# Altium project RemoteQuarium_pcb_design.PrjPcb
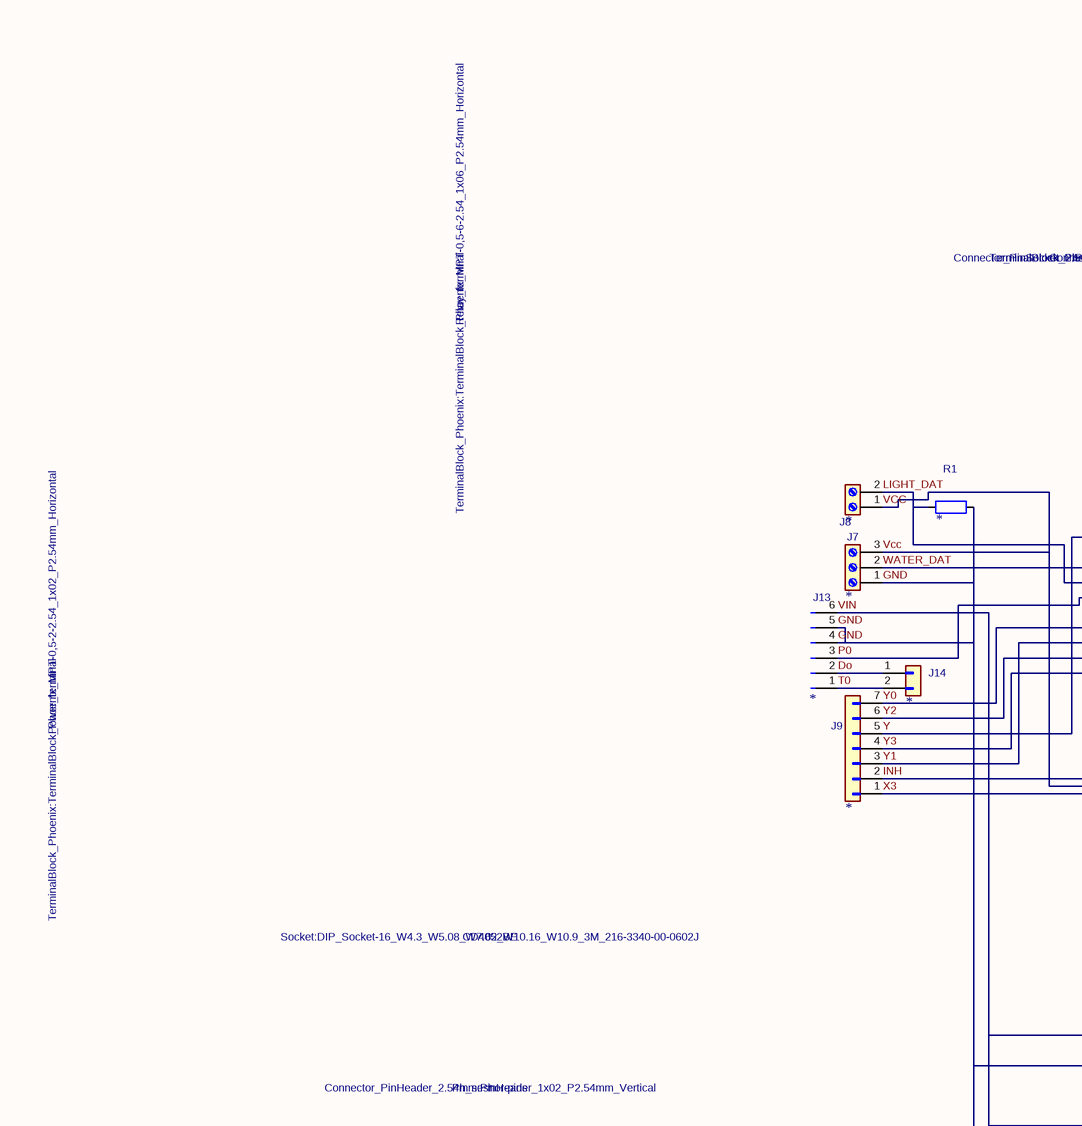
[diagram p0: RemoteQuarium_pcb_design.SchDoc, top left]
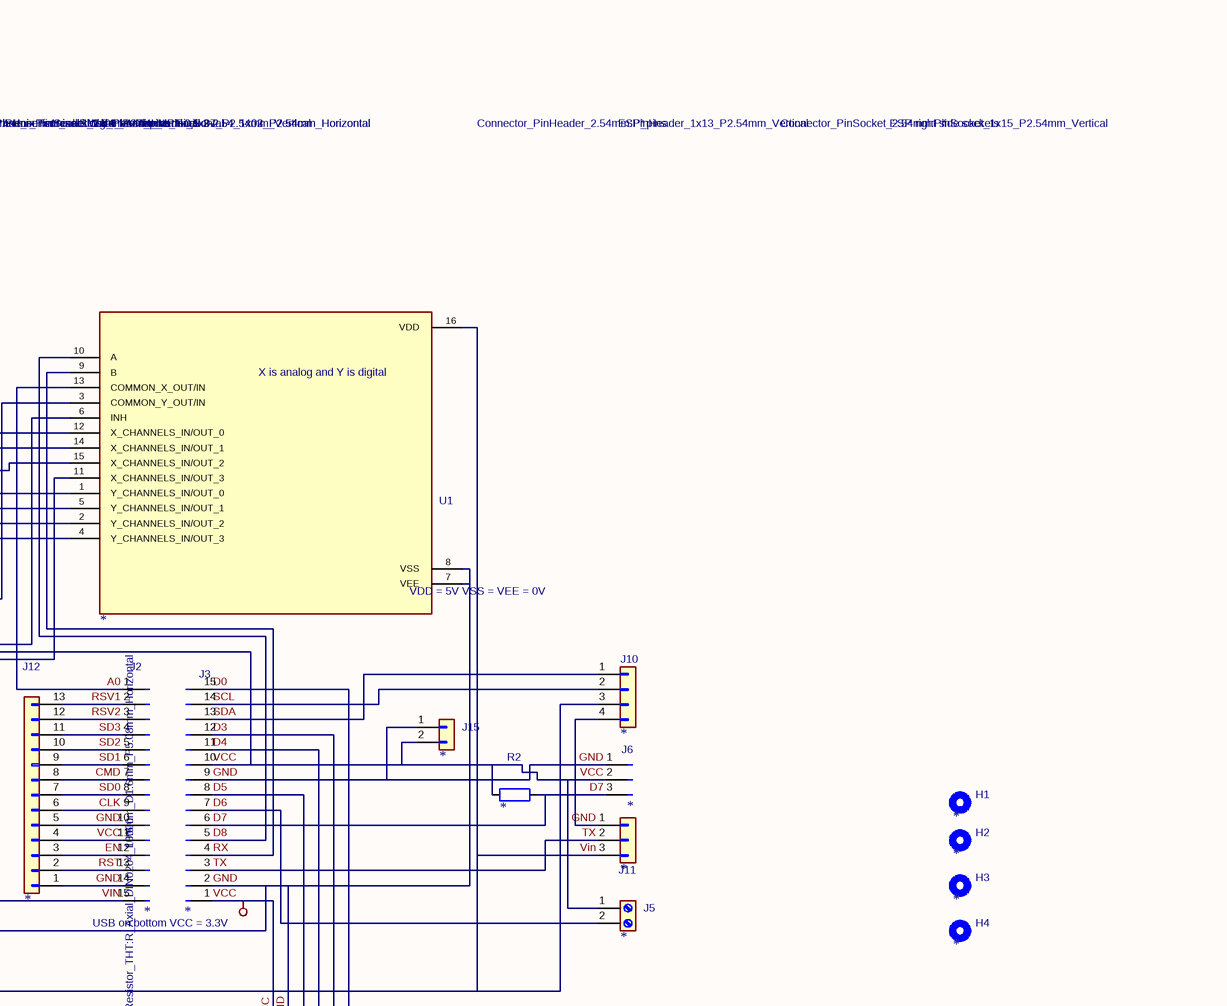
[diagram p1: RemoteQuarium_pcb_design.SchDoc, top right]
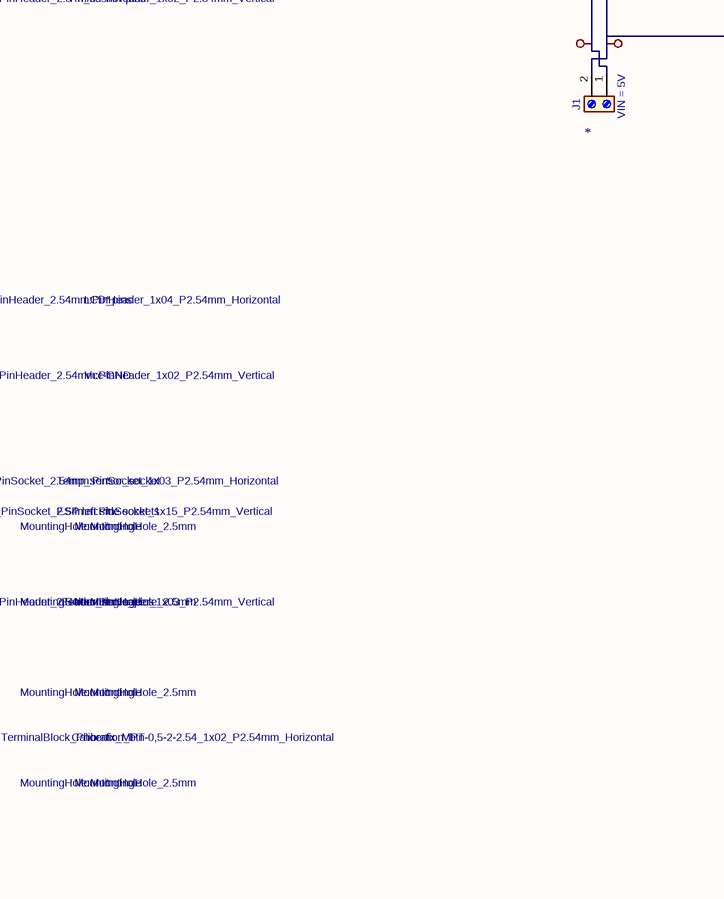
[diagram p2: RemoteQuarium_pcb_design.SchDoc, bottom left]
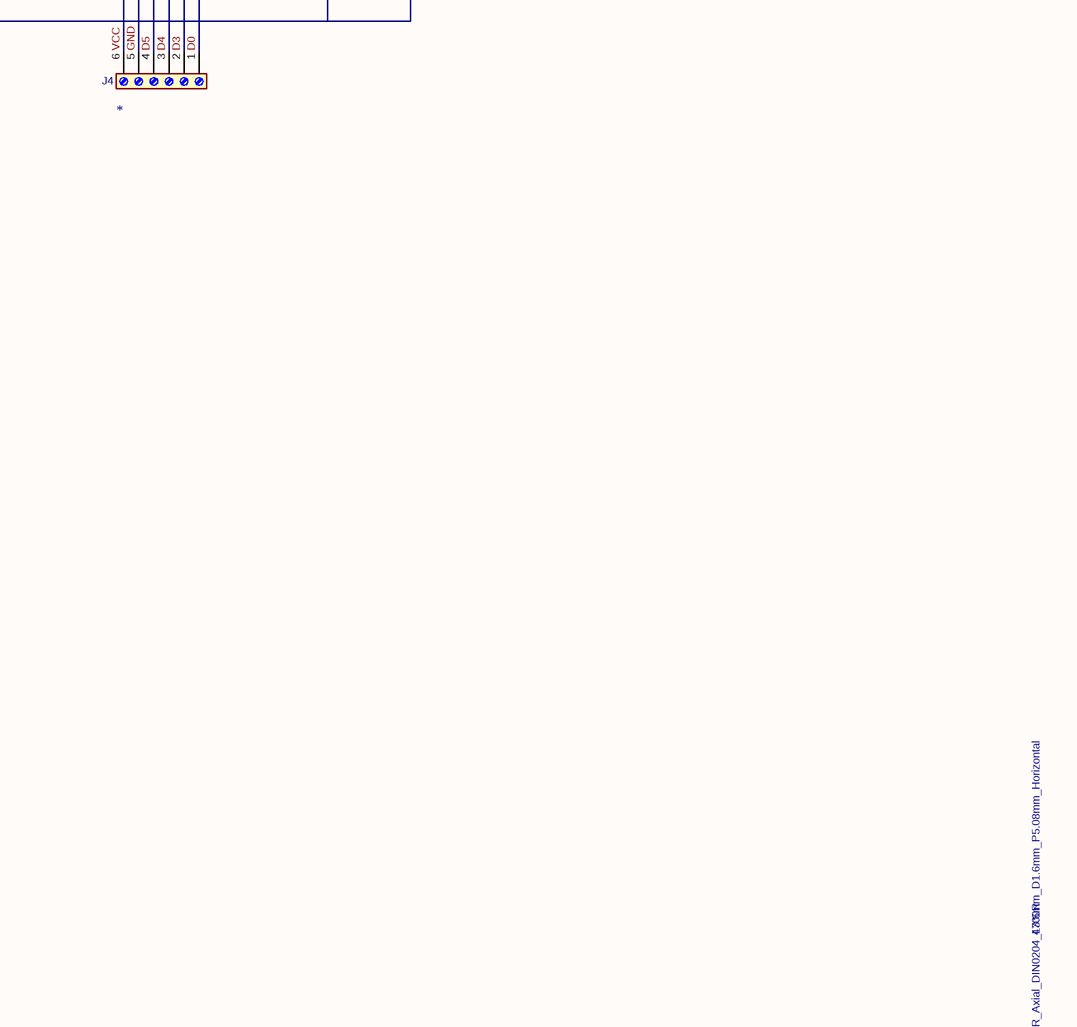
[diagram p3: RemoteQuarium_pcb_design.SchDoc, bottom right]
1 sheet, 22 parts. Net scope: global (net labels, ports and power ports of the same name join across sheets).
Board file: RemoteQuarium_pcb_design.PcbDoc

## Sheet RemoteQuarium_pcb_design.SchDoc
size 297 x 209 mm

### Parts
(Parts that share a designator on the sheet are numbered #1, #2 ... from top to bottom, then left to right.)
*#1  *  value Light_sensor_terminal  Reference: J8  Footprint: TerminalBlock_Phoenix:TerminalBlock_Phoenix_MPT-0,5-2-2.54_1x02_P2.54mm_Horizontal
*#2  *  value 10000  Reference: R1  Footprint: Resistor_THT:R_Axial_DIN0204_L3.6mm_D1.6mm_P5.08mm_Horizontal
*#3  *  value Water_sensor_terminal  Reference: J7  Footprint: TerminalBlock_Phoenix:TerminalBlock_Phoenix_MPT-0,5-3-2.54_1x03_P2.54mm_Horizontal
*#4  *  value CD4052BE  Reference: U1  Footprint: Socket:DIP_Socket-16_W4.3_W5.08_W7.62_W10.16_W10.9_3M_216-3340-00-0602J
*#5  *  value PH_sensor_sockets  Reference: J13  Footprint: Connector_PinSocket_2.54mm:PinSocket_1x06_P2.54mm_Horizontal
*#6  *  value Ph_sesnor-pins  Reference: J14  Footprint: Connector_PinHeader_2.54mm:PinHeader_1x02_P2.54mm_Vertical
*#7  *  value MUX_pins  Reference: J9  Footprint: Connector_PinHeader_2.54mm:PinHeader_1x07_P2.54mm_Vertical
*#8  *  value LCD_pins  Reference: J10  Footprint: Connector_PinHeader_2.54mm:PinHeader_1x04_P2.54mm_Horizontal
*#9  *  value Vcc-GND  Reference: J15  Footprint: Connector_PinHeader_2.54mm:PinHeader_1x02_P2.54mm_Vertical
*#10  *  value Temp_sensor_socket  Reference: J6  Footprint: Connector_PinSocket_2.54mm:PinSocket_1x03_P2.54mm_Horizontal
*#11  *  value ESP_pins  Reference: J12  Footprint: Connector_PinHeader_2.54mm:PinHeader_1x13_P2.54mm_Vertical
*#12  *  value ESP left side sockets  Reference: J2  Footprint: Connector_PinSocket_2.54mm:PinSocket_1x15_P2.54mm_Vertical
*#13  *  value ESP right side sockets  Reference: J3  Footprint: Connector_PinSocket_2.54mm:PinSocket_1x15_P2.54mm_Vertical
*#14  *  value 4700R  Reference: R2  Footprint: Resistor_THT:R_Axial_DIN0204_L3.6mm_D1.6mm_P5.08mm_Horizontal
*#15  *  value MountingHole  Reference: H1  Footprint: MountingHole:MountingHole_2.5mm
*#16  *  value Feeder_servo_pins  Reference: J11  Footprint: Connector_PinHeader_2.54mm:PinHeader_1x03_P2.54mm_Vertical
*#17  *  value MountingHole  Reference: H2  Footprint: MountingHole:MountingHole_2.5mm
*#18  *  value MountingHole  Reference: H3  Footprint: MountingHole:MountingHole_2.5mm
*#19  *  value Calibration_btn  Reference: J5  Footprint: TerminalBlock_Phoenix:TerminalBlock_Phoenix_MPT-0,5-2-2.54_1x02_P2.54mm_Horizontal
*#20  *  value MountingHole  Reference: H4  Footprint: MountingHole:MountingHole_2.5mm
*#21  *  value Relay_terminal  Reference: J4  Footprint: TerminalBlock_Phoenix:TerminalBlock_Phoenix_MPT-0,5-6-2.54_1x06_P2.54mm_Horizontal
*#22  *  value Power_terminal  Reference: J1  Footprint: TerminalBlock_Phoenix:TerminalBlock_Phoenix_MPT-0,5-2-2.54_1x02_P2.54mm_Horizontal

### Nets
GND: *#1.1(Pin_1) *#2.2 *#3.1(Pin_1) *#3.3(Pin_3) *#4.7(VEE) *#4.8(VSS) *#4.16(VDD) *#5.4(Pin_4) *#5.5(Pin_5) *#5.6(Pin_6) *#8.3(Pin_3) *#8.4(Pin_4) *#9.1(Pin_1) *#9.2(Pin_2) *#10.1(Pin_1) *#10.2(Pin_2) *#11.1(Pin_1) *#11.4(Pin_4) *#11.5(Pin_5) *#12.10(Pin_10) *#12.11(Pin_11) *#12.14(Pin_14) *#12.15(Pin_15) *#13.1(Pin_1) *#13.2(Pin_2) *#13.9(Pin_9) *#13.10(Pin_10) *#14.1 *#16.1(Pin_1) *#16.3(Pin_3) *#19.1(Pin_1) *#21.5(Pin_5) *#21.6(Pin_6) *#22.1(Pin_1) *#22.2(Pin_2)  [also labelled VCC, VIN]
A0: *#4.13(COMMON_X_OUT/IN) *#12.1(Pin_1)
CLK: *#11.6(Pin_6) *#12.9(Pin_9)
CMD: *#11.8(Pin_8) *#12.7(Pin_7)
D0: *#13.15(Pin_15) *#21.1(Pin_1)
D3: *#13.12(Pin_12) *#21.2(Pin_2)
D4: *#13.11(Pin_11) *#21.3(Pin_3)
D5: *#13.8(Pin_8) *#21.4(Pin_4)
D6: *#13.7(Pin_7) *#19.2(Pin_2)
D7: *#10.3(Pin_3) *#13.6(Pin_6) *#14.2
D8: *#4.10(A) *#13.5(Pin_5)
Do: *#5.2(Pin_2) *#6.1(Pin_1)
EN: *#11.3(Pin_3) *#12.12(Pin_12)
INH: *#4.6(INH) *#7.2(Pin_2)
LIGHT_DAT: *#1.2(Pin_2) *#2.1 *#4.14(X_CHANNELS_IN/OUT_1)
P0: *#4.15(X_CHANNELS_IN/OUT_2) *#5.3(Pin_3)
RST: *#11.2(Pin_2) *#12.13(Pin_13)
RSV1: *#11.13(Pin_13) *#12.2(Pin_2)
RSV2: *#11.12(Pin_12) *#12.3(Pin_3)
RX: *#4.9(B) *#13.4(Pin_4)
SCL: *#8.2(Pin_2) *#13.14(Pin_14)
SD0: *#11.7(Pin_7) *#12.8(Pin_8)
SD1: *#11.9(Pin_9) *#12.6(Pin_6)
SD2: *#11.10(Pin_10) *#12.5(Pin_5)
SD3: *#11.11(Pin_11) *#12.4(Pin_4)
SDA: *#8.1(Pin_1) *#13.13(Pin_13)
T0: *#5.1(Pin_1) *#6.2(Pin_2)
TX: *#13.3(Pin_3) *#16.2(Pin_2)
WATER_DAT: *#3.2(Pin_2) *#4.12(X_CHANNELS_IN/OUT_0)
X3: *#4.11(X_CHANNELS_IN/OUT_3) *#7.1(Pin_1)
Y: *#4.3(COMMON_Y_OUT/IN) *#7.5(Pin_5)
Y0: *#4.1(Y_CHANNELS_IN/OUT_0) *#7.7(Pin_7)
Y1: *#4.5(Y_CHANNELS_IN/OUT_1) *#7.3(Pin_3)
Y2: *#4.2(Y_CHANNELS_IN/OUT_2) *#7.6(Pin_6)
Y3: *#4.4(Y_CHANNELS_IN/OUT_3) *#7.4(Pin_4)

### Notes on the sheet
- (near *#4) X is analog and Y is digital
- (near *#4) VDD = 5V
  VSS = VEE = 0V
- (near *#13) USB on bottom
  VCC = 3.3V
- (near *#22) VIN = 5V
- 1
- 2
- 3
- 4
- 5
- 6
- A
- B
- C
- D
- Title:
- File: RemoteQuarium_pcb_design.kicad_sch
- Sheet: /
- KiCad E.D.A.  kicad (5.1.4)-1
- Size: A4
- Date:
- Rev:
- Id: 1/1

### Library data of the parts
*#1 *#19 *#22 = Screw_Terminal_01x02: Datasheet: ~
*#2 *#14 = R: Datasheet: ~
*#3 = Screw_Terminal_01x03: Datasheet: ~
*#4 = CD4052BE: MF: Texas Instruments; Description: \n20-V, 4:1, 2-channel general-purpose multiplexer\n; Package: PDIP-16 Texas Instruments; Price: None; SnapEDA_Link: https://www.snapeda.com/parts/CD4052BE/Texas+Instruments/view-part/?ref=snap; MP: CD4052BE; Purchase-URL: https://www.snapeda.com/api/url_track_click_mouser/?unipart_id=229377&manufacturer=Texas Instruments&part_name=CD4052BE&search_term=None; Availability: In Stock; Check_prices: https://www.snapeda.com/parts/CD4052BE/Texas+Instruments/view-part/?ref=eda
*#5 = Conn_01x06_Socket: Datasheet: ~
*#6 *#9 = Conn_01x02: Datasheet: ~
*#7 = Conn_01x07: Datasheet: ~
*#8 = Conn_01x04: Datasheet: ~
*#10 = Conn_01x03_Socket: Datasheet: ~
*#11 = Conn_01x13: Datasheet: ~
*#12 *#13 = Conn_01x15_Socket: Datasheet: ~
*#15 *#17 *#18 *#20 = MountingHole: Datasheet: ~
*#16 = Conn_01x03: Datasheet: ~
*#21 = Screw_Terminal_01x06: Datasheet: ~